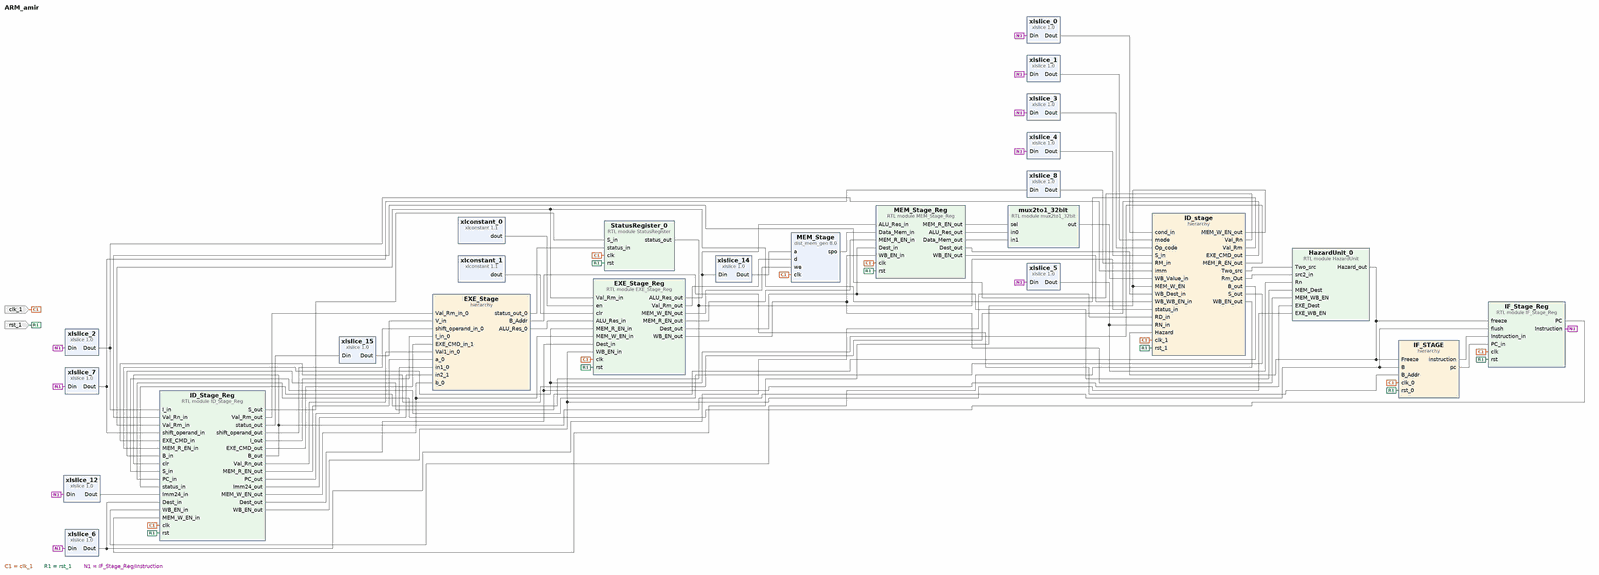
[diagram p0: block diagram of the top level, whole]
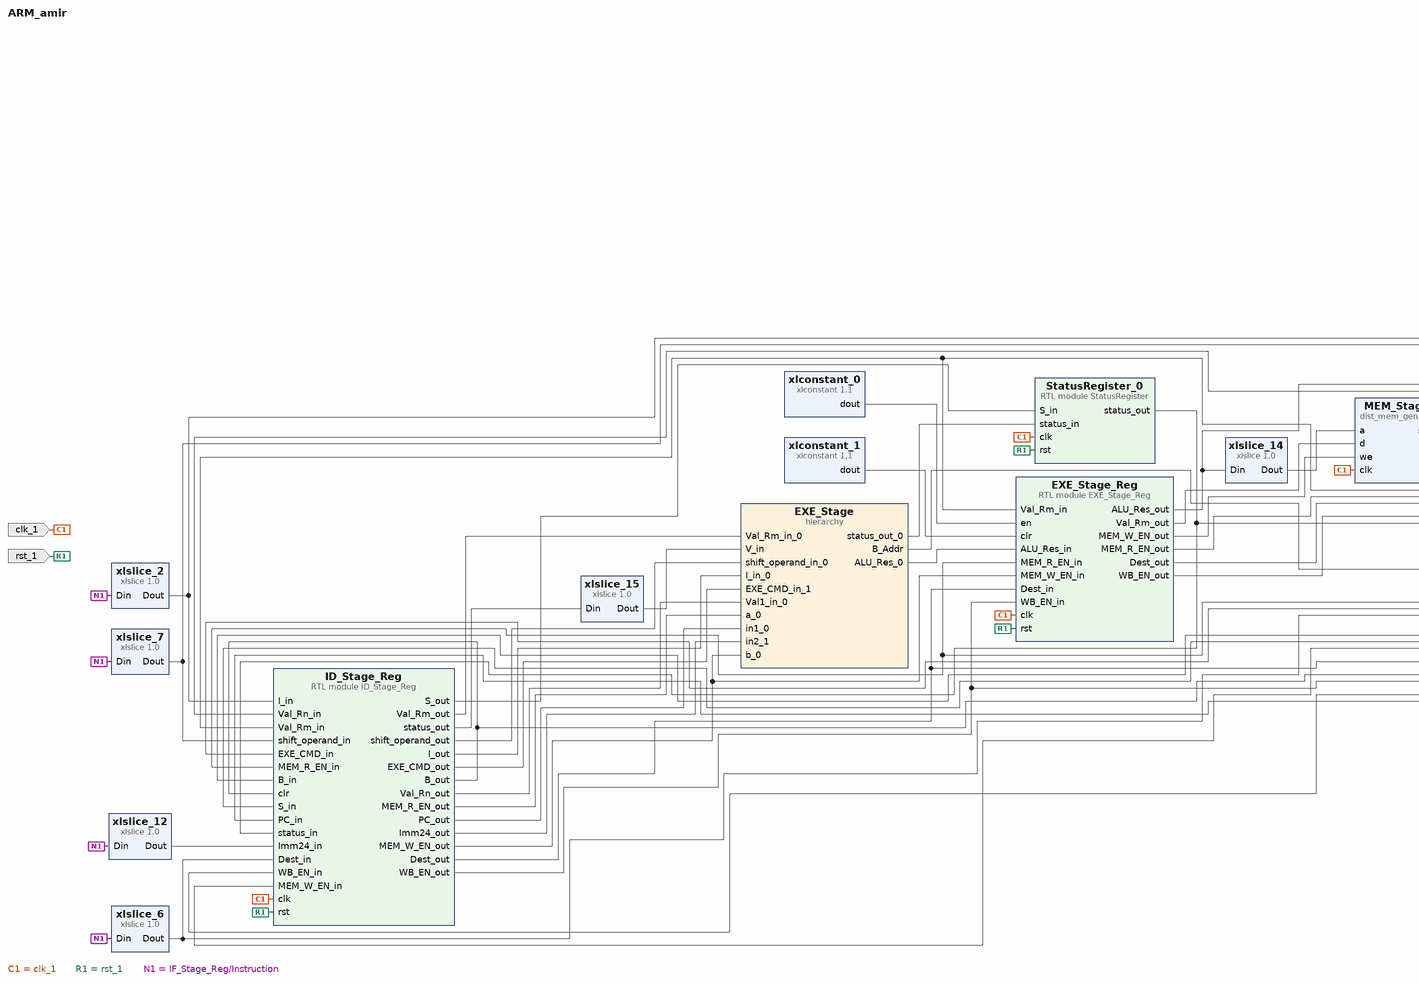
[diagram p1: block diagram of the top level, left part]
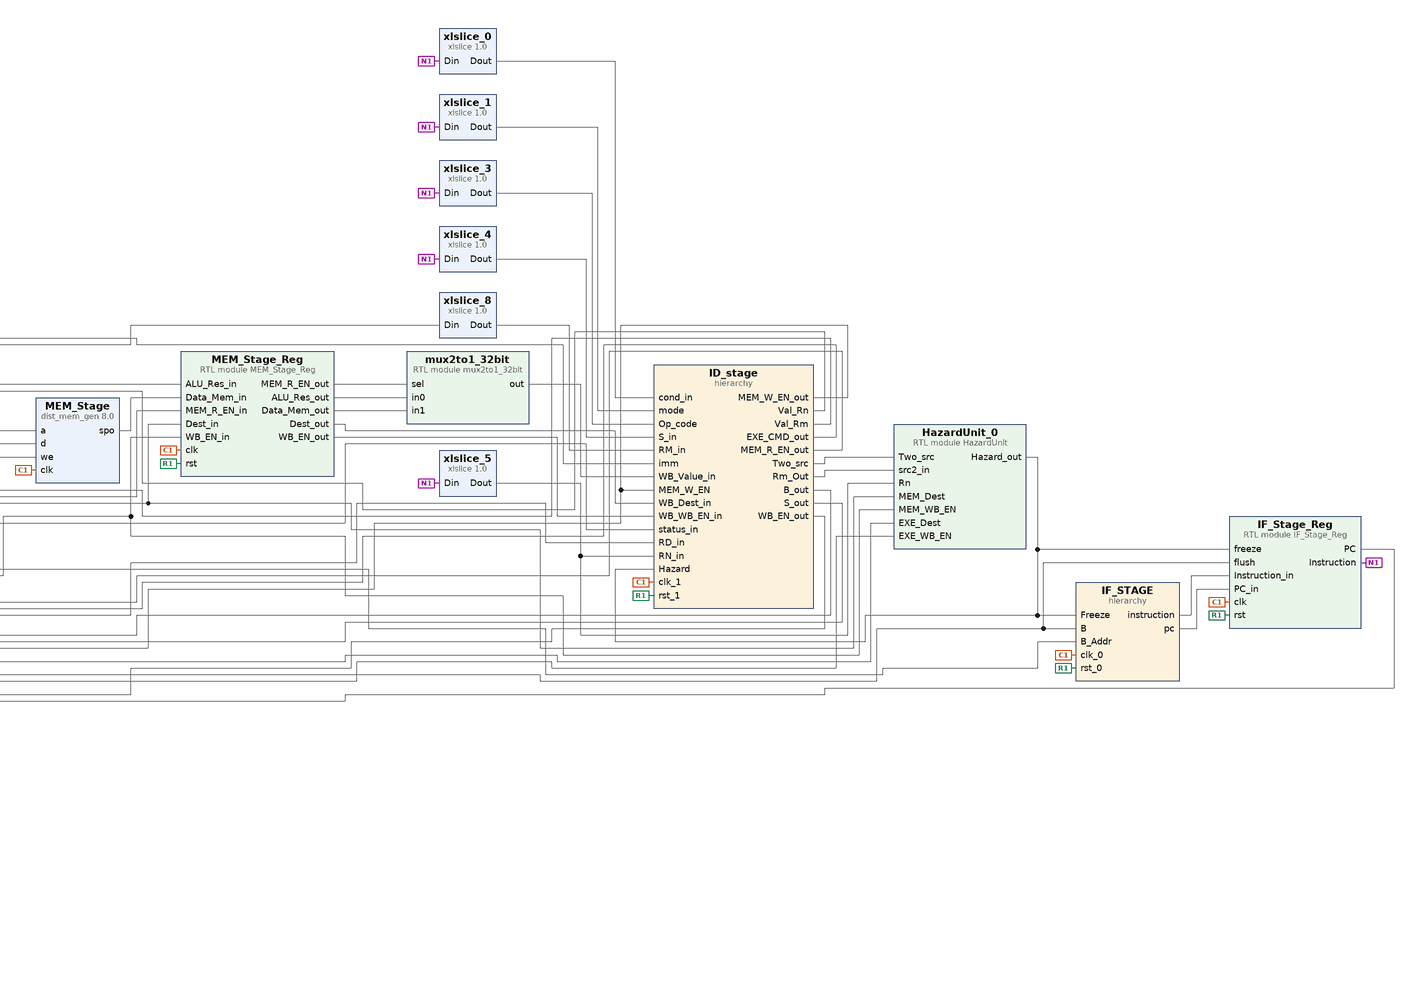
[diagram p2: block diagram of the top level, right part]
# Vivado block design ARM_amir, xc7z010clg400-1, Vivado 2018.3
create_bd_design ARM_amir

create_bd_port -dir I -type clk clk_1
create_bd_port -dir I -type rst rst_1
set_property -dict {CONFIG.POLARITY ACTIVE_HIGH} [get_bd_ports rst_1]

create_bd_cell -type hier IF_STAGE
create_bd_cell -type hier ID_stage
create_bd_cell -type ip -vlnv xilinx.com:ip:xlslice:1.0 xlslice_0
set_property -dict {CONFIG.DIN_FROM 31 CONFIG.DIN_TO 28 CONFIG.DOUT_WIDTH 4} [get_bd_cells xlslice_0]
create_bd_cell -type ip -vlnv xilinx.com:ip:xlslice:1.0 xlslice_1
set_property -dict {CONFIG.DIN_FROM 27 CONFIG.DIN_TO 26 CONFIG.DOUT_WIDTH 2} [get_bd_cells xlslice_1]
create_bd_cell -type ip -vlnv xilinx.com:ip:xlslice:1.0 xlslice_2
set_property -dict {CONFIG.DIN_FROM 25 CONFIG.DIN_TO 25 CONFIG.DOUT_WIDTH 1} [get_bd_cells xlslice_2]
create_bd_cell -type module -reference IF_Stage_Reg IF_Stage_Reg
create_bd_cell -type ip -vlnv xilinx.com:ip:xlslice:1.0 xlslice_3
set_property -dict {CONFIG.DIN_FROM 24 CONFIG.DIN_TO 21 CONFIG.DOUT_WIDTH 4} [get_bd_cells xlslice_3]
create_bd_cell -type ip -vlnv xilinx.com:ip:xlslice:1.0 xlslice_4
set_property -dict {CONFIG.DIN_FROM 20 CONFIG.DIN_TO 20 CONFIG.DOUT_WIDTH 1} [get_bd_cells xlslice_4]
create_bd_cell -type ip -vlnv xilinx.com:ip:xlslice:1.0 xlslice_5
set_property -dict {CONFIG.DIN_FROM 19 CONFIG.DIN_TO 16 CONFIG.DOUT_WIDTH 4} [get_bd_cells xlslice_5]
create_bd_cell -type ip -vlnv xilinx.com:ip:xlslice:1.0 xlslice_6
set_property -dict {CONFIG.DIN_FROM 15 CONFIG.DIN_TO 12 CONFIG.DOUT_WIDTH 4} [get_bd_cells xlslice_6]
create_bd_cell -type ip -vlnv xilinx.com:ip:xlslice:1.0 xlslice_7
set_property -dict {CONFIG.DIN_FROM 11 CONFIG.DOUT_WIDTH 12} [get_bd_cells xlslice_7]
create_bd_cell -type ip -vlnv xilinx.com:ip:xlslice:1.0 xlslice_8
set_property -dict {CONFIG.DIN_FROM 3 CONFIG.DIN_TO 0 CONFIG.DIN_WIDTH 12 CONFIG.DOUT_WIDTH 4} [get_bd_cells xlslice_8]
create_bd_cell -type module -reference ID_Stage_Reg ID_Stage_Reg
create_bd_cell -type ip -vlnv xilinx.com:ip:xlslice:1.0 xlslice_12
set_property -dict {CONFIG.DIN_FROM 23 CONFIG.DOUT_WIDTH 24} [get_bd_cells xlslice_12]
create_bd_cell -type hier EXE_Stage
create_bd_cell -type module -reference EXE_Stage_Reg EXE_Stage_Reg
create_bd_cell -type ip -vlnv xilinx.com:ip:dist_mem_gen:8.0 MEM_Stage
set_property -dict [list \
  CONFIG.coefficient_file c:/Users/amiri/OneDrive/Desktop/output.coe \
  CONFIG.data_width 32 \
  CONFIG.depth 8192 \
] [get_bd_cells MEM_Stage]
create_bd_cell -type ip -vlnv xilinx.com:ip:xlslice:1.0 xlslice_14
set_property -dict {CONFIG.DIN_FROM 12 CONFIG.DIN_TO 0 CONFIG.DIN_WIDTH 32 CONFIG.DOUT_WIDTH 13} [get_bd_cells xlslice_14]
create_bd_cell -type module -reference MEM_Stage_Reg MEM_Stage_Reg
create_bd_cell -type module -reference mux2to1_32bit mux2to1_32bit
create_bd_cell -type module -reference HazardUnit HazardUnit_0
create_bd_cell -type module -reference StatusRegister StatusRegister_0
create_bd_cell -type ip -vlnv xilinx.com:ip:xlconstant:1.1 xlconstant_0
create_bd_cell -type ip -vlnv xilinx.com:ip:xlconstant:1.1 xlconstant_1
set_property -dict {CONFIG.CONST_VAL 0} [get_bd_cells xlconstant_1]
create_bd_cell -type ip -vlnv xilinx.com:ip:xlslice:1.0 xlslice_15
set_property -dict {CONFIG.DIN_FROM 3 CONFIG.DIN_TO 3 CONFIG.DIN_WIDTH 4 CONFIG.DOUT_WIDTH 1} [get_bd_cells xlslice_15]

# ---- hierarchy /IF_STAGE ----
current_bd_instance /IF_STAGE
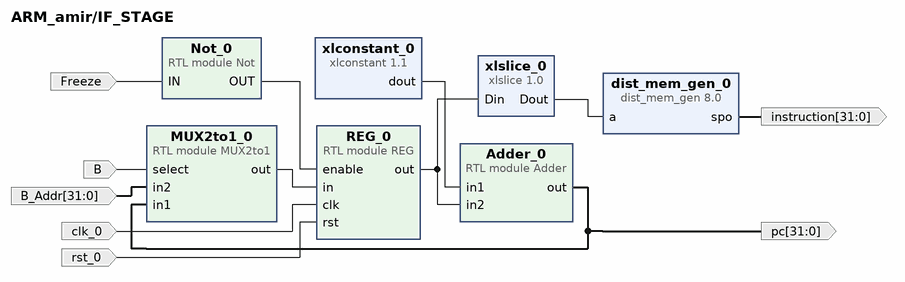
[diagram p3: block diagram inside /IF_STAGE]
create_bd_pin -dir O -from 31 -to 0 pc
create_bd_pin -dir I B
create_bd_pin -dir I -from 31 -to 0 B_Addr
create_bd_pin -dir I -type clk clk_0
create_bd_pin -dir I -type rst rst_0
create_bd_pin -dir O -from 31 -to 0 instruction
create_bd_pin -dir I Freeze

create_bd_cell -type module -reference MUX2to1 MUX2to1_0
create_bd_cell -type ip -vlnv xilinx.com:ip:xlconstant:1.1 xlconstant_0
set_property -dict {CONFIG.CONST_WIDTH 32} [get_bd_cells xlconstant_0]
create_bd_cell -type ip -vlnv xilinx.com:ip:dist_mem_gen:8.0 dist_mem_gen_0
set_property -dict [list \
  CONFIG.coefficient_file c:/Users/amiri/OneDrive/Desktop/output.coe \
  CONFIG.data_width 32 \
  CONFIG.depth 8192 \
  CONFIG.memory_type rom \
] [get_bd_cells dist_mem_gen_0]
create_bd_cell -type ip -vlnv xilinx.com:ip:xlslice:1.0 xlslice_0
set_property -dict {CONFIG.DIN_FROM 12 CONFIG.DOUT_WIDTH 13} [get_bd_cells xlslice_0]
create_bd_cell -type module -reference REG REG_0
create_bd_cell -type module -reference Not Not_0
create_bd_cell -type module -reference Adder Adder_0

# ---- hierarchy /ID_stage ----
current_bd_instance /ID_stage
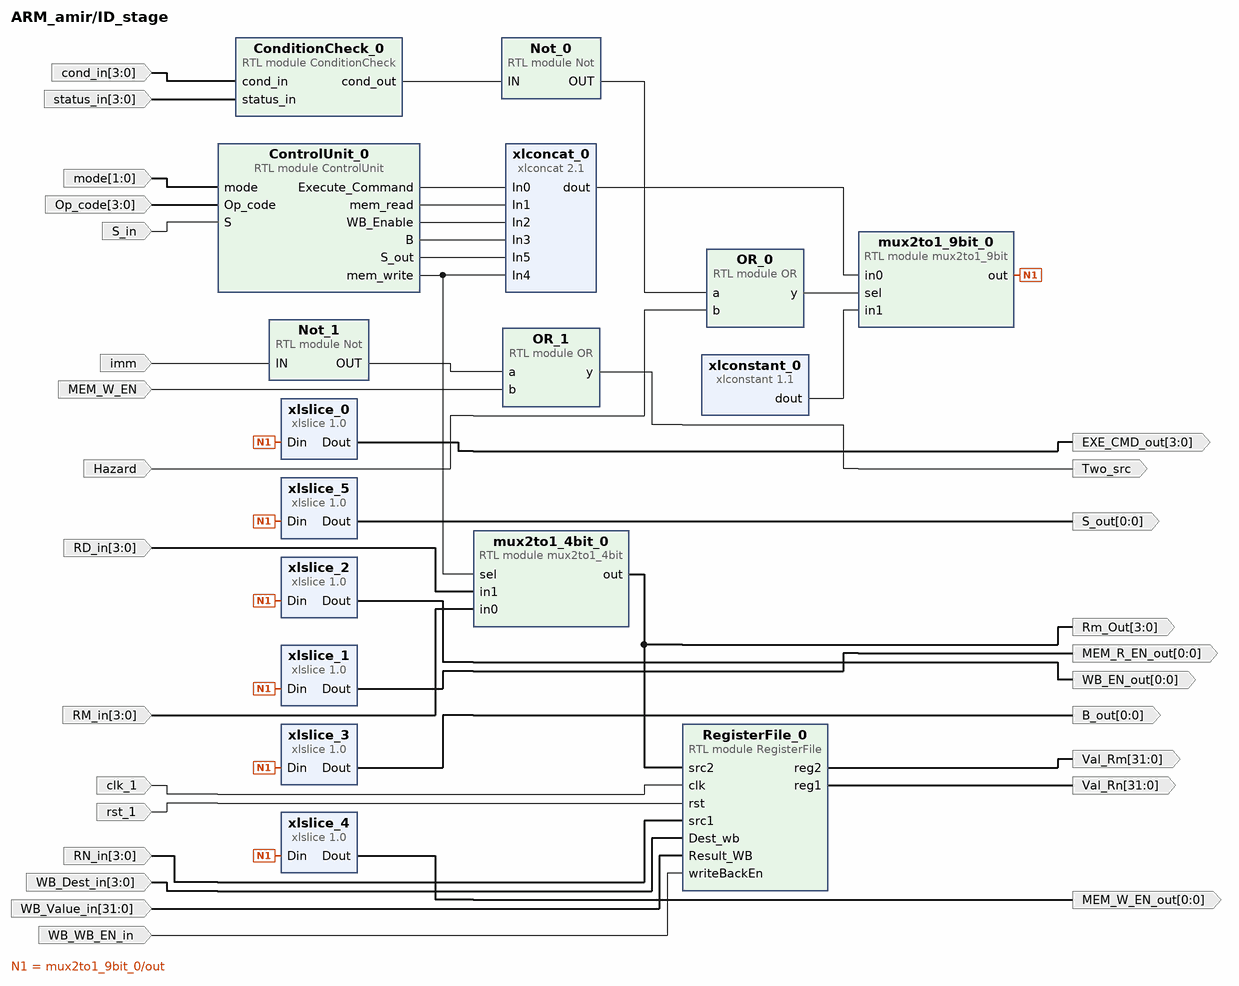
[diagram p4: block diagram inside /ID_stage]
create_bd_pin -dir I -from 3 -to 0 cond_in
create_bd_pin -dir I -from 3 -to 0 status_in
create_bd_pin -dir I -from 1 -to 0 mode
create_bd_pin -dir I -from 3 -to 0 Op_code
create_bd_pin -dir I S_in
create_bd_pin -dir I imm
create_bd_pin -dir I Hazard
create_bd_pin -dir I MEM_W_EN
create_bd_pin -dir O Two_src
create_bd_pin -dir I -type clk clk_1
create_bd_pin -dir I -type rst rst_1
create_bd_pin -dir I -from 3 -to 0 RN_in
create_bd_pin -dir I -from 3 -to 0 WB_Dest_in
create_bd_pin -dir I -from 31 -to 0 WB_Value_in
create_bd_pin -dir I WB_WB_EN_in
create_bd_pin -dir O -from 31 -to 0 Val_Rn
create_bd_pin -dir O -from 31 -to 0 Val_Rm
create_bd_pin -dir I -from 3 -to 0 RD_in
create_bd_pin -dir I -from 3 -to 0 RM_in
create_bd_pin -dir O -from 3 -to 0 EXE_CMD_out
create_bd_pin -dir O -from 0 -to 0 WB_EN_out
create_bd_pin -dir O -from 0 -to 0 MEM_R_EN_out
create_bd_pin -dir O -from 0 -to 0 MEM_W_EN_out
create_bd_pin -dir O -from 0 -to 0 B_out
create_bd_pin -dir O -from 0 -to 0 S_out
create_bd_pin -dir O -from 3 -to 0 Rm_Out

create_bd_cell -type module -reference ConditionCheck ConditionCheck_0
create_bd_cell -type module -reference Not Not_1
create_bd_cell -type module -reference OR OR_1
create_bd_cell -type module -reference RegisterFile RegisterFile_0
create_bd_cell -type module -reference mux2to1_4bit mux2to1_4bit_0
create_bd_cell -type module -reference mux2to1_9bit mux2to1_9bit_0
create_bd_cell -type ip -vlnv xilinx.com:ip:xlconcat:2.1 xlconcat_0
set_property -dict {CONFIG.IN0_WIDTH 4 CONFIG.NUM_PORTS 6} [get_bd_cells xlconcat_0]
create_bd_cell -type ip -vlnv xilinx.com:ip:xlconstant:1.1 xlconstant_0
set_property -dict {CONFIG.CONST_VAL 0 CONFIG.CONST_WIDTH 9} [get_bd_cells xlconstant_0]
create_bd_cell -type ip -vlnv xilinx.com:ip:xlslice:1.0 xlslice_0
set_property -dict {CONFIG.DIN_FROM 3 CONFIG.DIN_TO 0 CONFIG.DIN_WIDTH 9 CONFIG.DOUT_WIDTH 4} [get_bd_cells xlslice_0]
create_bd_cell -type ip -vlnv xilinx.com:ip:xlslice:1.0 xlslice_1
set_property -dict {CONFIG.DIN_FROM 4 CONFIG.DIN_TO 4 CONFIG.DIN_WIDTH 9 CONFIG.DOUT_WIDTH 1} [get_bd_cells xlslice_1]
create_bd_cell -type ip -vlnv xilinx.com:ip:xlslice:1.0 xlslice_2
set_property -dict {CONFIG.DIN_FROM 5 CONFIG.DIN_TO 5 CONFIG.DIN_WIDTH 9} [get_bd_cells xlslice_2]
create_bd_cell -type ip -vlnv xilinx.com:ip:xlslice:1.0 xlslice_3
set_property -dict {CONFIG.DIN_FROM 6 CONFIG.DIN_TO 6 CONFIG.DIN_WIDTH 9 CONFIG.DOUT_WIDTH 1} [get_bd_cells xlslice_3]
create_bd_cell -type ip -vlnv xilinx.com:ip:xlslice:1.0 xlslice_4
set_property -dict {CONFIG.DIN_FROM 7 CONFIG.DIN_TO 7 CONFIG.DIN_WIDTH 9 CONFIG.DOUT_WIDTH 1} [get_bd_cells xlslice_4]
create_bd_cell -type ip -vlnv xilinx.com:ip:xlslice:1.0 xlslice_5
set_property -dict {CONFIG.DIN_FROM 8 CONFIG.DIN_TO 8 CONFIG.DIN_WIDTH 9 CONFIG.DOUT_WIDTH 1} [get_bd_cells xlslice_5]
create_bd_cell -type module -reference OR OR_0
create_bd_cell -type module -reference Not Not_0
create_bd_cell -type module -reference ControlUnit ControlUnit_0

# ---- hierarchy /EXE_Stage ----
current_bd_instance /EXE_Stage
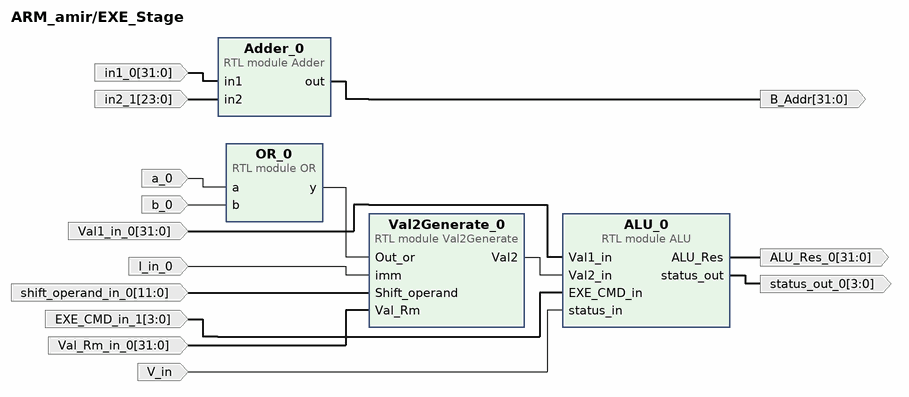
[diagram p5: block diagram inside /EXE_Stage]
create_bd_pin -dir I -from 31 -to 0 Val1_in_0
create_bd_pin -dir I -from 3 -to 0 EXE_CMD_in_1
create_bd_pin -dir I V_in
create_bd_pin -dir O -from 3 -to 0 status_out_0
create_bd_pin -dir O -from 31 -to 0 ALU_Res_0
create_bd_pin -dir I -from 31 -to 0 in1_0
create_bd_pin -dir I -from 23 -to 0 in2_1
create_bd_pin -dir O -from 31 -to 0 B_Addr
create_bd_pin -dir I a_0
create_bd_pin -dir I b_0
create_bd_pin -dir I I_in_0
create_bd_pin -dir I -from 11 -to 0 shift_operand_in_0
create_bd_pin -dir I -from 31 -to 0 Val_Rm_in_0

create_bd_cell -type module -reference ALU ALU_0
create_bd_cell -type module -reference OR OR_0
create_bd_cell -type module -reference Adder Adder_0
create_bd_cell -type module -reference Val2Generate Val2Generate_0

# ---- connections ----

current_bd_instance /IF_STAGE
connect_bd_net [get_bd_pins xlconstant_0/dout] [get_bd_pins Adder_0/in1]
connect_bd_net [get_bd_pins REG_0/out] [get_bd_pins xlslice_0/Din] [get_bd_pins Adder_0/in2]
connect_bd_net [get_bd_pins MUX2to1_0/out] [get_bd_pins REG_0/in]
connect_bd_net [get_bd_pins Adder_0/out] [get_bd_pins pc] [get_bd_pins MUX2to1_0/in1]
connect_bd_net -net select_0_1 [get_bd_pins B] [get_bd_pins MUX2to1_0/select]
connect_bd_net -net in2_0_1 [get_bd_pins B_Addr] [get_bd_pins MUX2to1_0/in2]
connect_bd_net -net clk_0_1 [get_bd_pins clk_0] [get_bd_pins REG_0/clk]
connect_bd_net [get_bd_pins dist_mem_gen_0/spo] [get_bd_pins instruction]
connect_bd_net [get_bd_pins xlslice_0/Dout] [get_bd_pins dist_mem_gen_0/a]
connect_bd_net -net rst_0_1 [get_bd_pins rst_0] [get_bd_pins REG_0/rst]
connect_bd_net [get_bd_pins Freeze] [get_bd_pins Not_0/IN]
connect_bd_net [get_bd_pins Not_0/OUT] [get_bd_pins REG_0/enable]

current_bd_instance /ID_stage
connect_bd_net [get_bd_pins ConditionCheck_0/cond_out] [get_bd_pins Not_0/IN]
connect_bd_net [get_bd_pins ControlUnit_0/Execute_Command] [get_bd_pins xlconcat_0/In0]
connect_bd_net [get_bd_pins ControlUnit_0/mem_read] [get_bd_pins xlconcat_0/In1]
connect_bd_net [get_bd_pins ControlUnit_0/mem_write] [get_bd_pins mux2to1_4bit_0/sel] [get_bd_pins xlconcat_0/In4]
connect_bd_net [get_bd_pins ControlUnit_0/WB_Enable] [get_bd_pins xlconcat_0/In2]
connect_bd_net [get_bd_pins ControlUnit_0/B] [get_bd_pins xlconcat_0/In3]
connect_bd_net [get_bd_pins ControlUnit_0/S_out] [get_bd_pins xlconcat_0/In5]
connect_bd_net [get_bd_pins Not_0/OUT] [get_bd_pins OR_0/a]
connect_bd_net [get_bd_pins Not_1/OUT] [get_bd_pins OR_1/a]
connect_bd_net [get_bd_pins OR_0/y] [get_bd_pins mux2to1_9bit_0/sel]
connect_bd_net [get_bd_pins xlconcat_0/dout] [get_bd_pins mux2to1_9bit_0/in0]
connect_bd_net [get_bd_pins xlconstant_0/dout] [get_bd_pins mux2to1_9bit_0/in1]
connect_bd_net [get_bd_pins mux2to1_9bit_0/out] \
  [get_bd_pins xlslice_0/Din] [get_bd_pins xlslice_1/Din] [get_bd_pins xlslice_2/Din] [get_bd_pins xlslice_3/Din] \
  [get_bd_pins xlslice_4/Din] [get_bd_pins xlslice_5/Din]
connect_bd_net -net cond_in_0_1 [get_bd_pins cond_in] [get_bd_pins ConditionCheck_0/cond_in]
connect_bd_net -net status_in_0_1 [get_bd_pins status_in] [get_bd_pins ConditionCheck_0/status_in]
connect_bd_net -net mode_0_1 [get_bd_pins mode] [get_bd_pins ControlUnit_0/mode]
connect_bd_net -net Op_code_0_1 [get_bd_pins Op_code] [get_bd_pins ControlUnit_0/Op_code]
connect_bd_net -net S_0_1 [get_bd_pins S_in] [get_bd_pins ControlUnit_0/S]
connect_bd_net -net IN_0_1 [get_bd_pins imm] [get_bd_pins Not_1/IN]
connect_bd_net -net b_0_1 [get_bd_pins Hazard] [get_bd_pins OR_0/b]
connect_bd_net -net b_1_1 [get_bd_pins MEM_W_EN] [get_bd_pins OR_1/b]
connect_bd_net [get_bd_pins OR_1/y] [get_bd_pins Two_src]
connect_bd_net -net clk_1_1 [get_bd_pins clk_1] [get_bd_pins RegisterFile_0/clk]
connect_bd_net -net rst_1_1 [get_bd_pins rst_1] [get_bd_pins RegisterFile_0/rst]
connect_bd_net -net src1_0_1 [get_bd_pins RN_in] [get_bd_pins RegisterFile_0/src1]
connect_bd_net -net Dest_wb_0_1 [get_bd_pins WB_Dest_in] [get_bd_pins RegisterFile_0/Dest_wb]
connect_bd_net -net Result_WB_0_1 [get_bd_pins WB_Value_in] [get_bd_pins RegisterFile_0/Result_WB]
connect_bd_net -net writeBackEn_0_1 [get_bd_pins WB_WB_EN_in] [get_bd_pins RegisterFile_0/writeBackEn]
connect_bd_net [get_bd_pins RegisterFile_0/reg1] [get_bd_pins Val_Rn]
connect_bd_net [get_bd_pins RegisterFile_0/reg2] [get_bd_pins Val_Rm]
connect_bd_net [get_bd_pins xlslice_0/Dout] [get_bd_pins EXE_CMD_out]
connect_bd_net [get_bd_pins xlslice_5/Dout] [get_bd_pins S_out]
connect_bd_net [get_bd_pins mux2to1_4bit_0/out] [get_bd_pins Rm_Out] [get_bd_pins RegisterFile_0/src2]
connect_bd_net [get_bd_pins xlslice_2/Dout] [get_bd_pins WB_EN_out]
connect_bd_net [get_bd_pins xlslice_1/Dout] [get_bd_pins MEM_R_EN_out]
connect_bd_net [get_bd_pins xlslice_3/Dout] [get_bd_pins B_out]
connect_bd_net [get_bd_pins xlslice_4/Dout] [get_bd_pins MEM_W_EN_out]
connect_bd_net [get_bd_pins RD_in] [get_bd_pins mux2to1_4bit_0/in1]
connect_bd_net [get_bd_pins RM_in] [get_bd_pins mux2to1_4bit_0/in0]

current_bd_instance /EXE_Stage
connect_bd_net [get_bd_pins Val2Generate_0/Val2] [get_bd_pins ALU_0/Val2_in]
connect_bd_net [get_bd_pins OR_0/y] [get_bd_pins Val2Generate_0/Out_or]
connect_bd_net -net Val1_in_0_1 [get_bd_pins Val1_in_0] [get_bd_pins ALU_0/Val1_in]
connect_bd_net -net EXE_CMD_in_1_1 [get_bd_pins EXE_CMD_in_1] [get_bd_pins ALU_0/EXE_CMD_in]
connect_bd_net -net status_in_2_1 [get_bd_pins V_in] [get_bd_pins ALU_0/status_in]
connect_bd_net [get_bd_pins ALU_0/status_out] [get_bd_pins status_out_0]
connect_bd_net [get_bd_pins ALU_0/ALU_Res] [get_bd_pins ALU_Res_0]
connect_bd_net -net in1_0_1 [get_bd_pins in1_0] [get_bd_pins Adder_0/in1]
connect_bd_net -net in2_1_1 [get_bd_pins in2_1] [get_bd_pins Adder_0/in2]
connect_bd_net [get_bd_pins Adder_0/out] [get_bd_pins B_Addr]
connect_bd_net -net a_0_1 [get_bd_pins a_0] [get_bd_pins OR_0/a]
connect_bd_net -net b_0_2 [get_bd_pins b_0] [get_bd_pins OR_0/b]
connect_bd_net -net I_in_0_1 [get_bd_pins I_in_0] [get_bd_pins Val2Generate_0/imm]
connect_bd_net -net shift_operand_in_0_1 [get_bd_pins shift_operand_in_0] [get_bd_pins Val2Generate_0/Shift_operand]
connect_bd_net -net Val_Rm_in_0_1 [get_bd_pins Val_Rm_in_0] [get_bd_pins Val2Generate_0/Val_Rm]

current_bd_instance /
connect_bd_net -net clk_1_1 [get_bd_ports clk_1] \
  [get_bd_pins ID_stage/clk_1] [get_bd_pins IF_STAGE/clk_0] [get_bd_pins StatusRegister_0/clk] \
  [get_bd_pins MEM_Stage_Reg/clk] [get_bd_pins MEM_Stage/clk] [get_bd_pins EXE_Stage_Reg/clk] [get_bd_pins IF_Stage_Reg/clk] \
  [get_bd_pins ID_Stage_Reg/clk]
connect_bd_net -net rst_1_1 [get_bd_ports rst_1] \
  [get_bd_pins ID_stage/rst_1] [get_bd_pins IF_STAGE/rst_0] [get_bd_pins StatusRegister_0/rst] \
  [get_bd_pins MEM_Stage_Reg/rst] [get_bd_pins EXE_Stage_Reg/rst] [get_bd_pins IF_Stage_Reg/rst] \
  [get_bd_pins ID_Stage_Reg/rst]
connect_bd_net [get_bd_pins IF_STAGE/instruction] [get_bd_pins IF_Stage_Reg/Instruction_in]
connect_bd_net -net IF_Stage_Reg_0_Instruction [get_bd_pins IF_Stage_Reg/Instruction] \
  [get_bd_pins xlslice_0/Din] [get_bd_pins xlslice_1/Din] [get_bd_pins xlslice_2/Din] [get_bd_pins xlslice_3/Din] \
  [get_bd_pins xlslice_4/Din] [get_bd_pins xlslice_5/Din] [get_bd_pins xlslice_6/Din] [get_bd_pins xlslice_7/Din] \
  [get_bd_pins xlslice_12/Din]
connect_bd_net [get_bd_pins xlslice_0/Dout] [get_bd_pins ID_stage/cond_in]
connect_bd_net [get_bd_pins xlslice_1/Dout] [get_bd_pins ID_stage/mode]
connect_bd_net -net imm_1 [get_bd_pins xlslice_2/Dout] [get_bd_pins ID_stage/imm] [get_bd_pins ID_Stage_Reg/I_in]
connect_bd_net [get_bd_pins xlslice_3/Dout] [get_bd_pins ID_stage/Op_code]
connect_bd_net -net S_in_1 [get_bd_pins xlslice_4/Dout] [get_bd_pins ID_stage/S_in]
connect_bd_net -net RN_in_1 [get_bd_pins xlslice_5/Dout] [get_bd_pins ID_stage/RN_in] [get_bd_pins HazardUnit_0/Rn]
connect_bd_net [get_bd_pins xlslice_7/Dout] [get_bd_pins xlslice_8/Din] [get_bd_pins ID_Stage_Reg/shift_operand_in]
connect_bd_net -net RM_in_1 [get_bd_pins xlslice_8/Dout] [get_bd_pins ID_stage/RM_in]
connect_bd_net [get_bd_pins ID_stage/Val_Rn] [get_bd_pins ID_Stage_Reg/Val_Rn_in]
connect_bd_net [get_bd_pins ID_stage/Val_Rm] [get_bd_pins ID_Stage_Reg/Val_Rm_in] [get_bd_pins EXE_Stage_Reg/Val_Rm_in]
connect_bd_net [get_bd_pins ID_stage/EXE_CMD_out] [get_bd_pins ID_Stage_Reg/EXE_CMD_in]
connect_bd_net [get_bd_pins ID_stage/MEM_R_EN_out] [get_bd_pins ID_Stage_Reg/MEM_R_EN_in] [get_bd_pins EXE_Stage_Reg/MEM_R_EN_in]
connect_bd_net [get_bd_pins ID_stage/B_out] [get_bd_pins ID_Stage_Reg/B_in]
connect_bd_net [get_bd_pins ID_stage/S_out] [get_bd_pins ID_Stage_Reg/S_in]
connect_bd_net [get_bd_pins xlslice_12/Dout] [get_bd_pins ID_Stage_Reg/Imm24_in]
connect_bd_net -net ID_Stage_Reg_0_Val_Rm_out [get_bd_pins ID_Stage_Reg/Val_Rm_out] [get_bd_pins EXE_Stage/Val_Rm_in_0]
connect_bd_net -net ID_Stage_Reg_0_shift_operand_out [get_bd_pins ID_Stage_Reg/shift_operand_out] [get_bd_pins EXE_Stage/shift_operand_in_0]
connect_bd_net -net ID_Stage_Reg_0_I_out [get_bd_pins ID_Stage_Reg/I_out] [get_bd_pins EXE_Stage/I_in_0]
connect_bd_net -net ID_Stage_Reg_0_EXE_CMD_out [get_bd_pins ID_Stage_Reg/EXE_CMD_out] [get_bd_pins EXE_Stage/EXE_CMD_in_1]
connect_bd_net -net ID_Stage_Reg_0_Val_Rn_out [get_bd_pins ID_Stage_Reg/Val_Rn_out] [get_bd_pins EXE_Stage/Val1_in_0]
connect_bd_net -net ID_Stage_Reg_0_MEM_R_EN_out [get_bd_pins ID_Stage_Reg/MEM_R_EN_out] [get_bd_pins EXE_Stage/a_0]
connect_bd_net -net ID_Stage_Reg_0_MEM_W_EN_out [get_bd_pins ID_Stage_Reg/MEM_W_EN_out] \
  [get_bd_pins EXE_Stage/b_0] [get_bd_pins EXE_Stage_Reg/MEM_W_EN_in]
connect_bd_net -net ID_Stage_Reg_0_PC_out [get_bd_pins ID_Stage_Reg/PC_out] [get_bd_pins EXE_Stage/in1_0]
connect_bd_net -net ID_Stage_Reg_0_Imm24_out [get_bd_pins ID_Stage_Reg/Imm24_out] [get_bd_pins EXE_Stage/in2_1]
connect_bd_net [get_bd_pins EXE_Stage/ALU_Res_0] [get_bd_pins EXE_Stage_Reg/ALU_Res_in]
connect_bd_net -net EXE_Stage_Reg_0_Val_Rm_out [get_bd_pins EXE_Stage_Reg/Val_Rm_out] [get_bd_pins MEM_Stage/d]
connect_bd_net [get_bd_pins xlslice_14/Dout] [get_bd_pins MEM_Stage/a]
connect_bd_net -net EXE_Stage_Reg_0_MEM_R_EN_out [get_bd_pins EXE_Stage_Reg/MEM_R_EN_out] [get_bd_pins MEM_Stage_Reg/MEM_R_EN_in]
connect_bd_net -net EXE_Stage_Reg_0_Dest_out [get_bd_pins EXE_Stage_Reg/Dest_out] \
  [get_bd_pins MEM_Stage_Reg/Dest_in] [get_bd_pins HazardUnit_0/MEM_Dest]
connect_bd_net -net dist_mem_gen_0_spo [get_bd_pins MEM_Stage/spo] [get_bd_pins MEM_Stage_Reg/Data_Mem_in]
connect_bd_net -net MEM_Stage_Reg_0_MEM_R_EN_out [get_bd_pins MEM_Stage_Reg/MEM_R_EN_out] [get_bd_pins mux2to1_32bit/sel]
connect_bd_net -net WB_Value_in_1 [get_bd_pins mux2to1_32bit/out] [get_bd_pins ID_stage/WB_Value_in]
connect_bd_net -net MEM_Stage_Reg_0_Dest_out [get_bd_pins MEM_Stage_Reg/Dest_out] [get_bd_pins ID_stage/WB_Dest_in]
connect_bd_net -net MEM_Stage_Reg_0_WB_EN_out [get_bd_pins MEM_Stage_Reg/WB_EN_out] [get_bd_pins ID_stage/WB_WB_EN_in]
connect_bd_net [get_bd_pins HazardUnit_0/Hazard_out] [get_bd_pins IF_Stage_Reg/freeze] [get_bd_pins ID_stage/Hazard] [get_bd_pins IF_STAGE/Freeze]
connect_bd_net -net ID_Stage_Reg_0_B_out [get_bd_pins ID_Stage_Reg/B_out] \
  [get_bd_pins IF_STAGE/B] [get_bd_pins IF_Stage_Reg/flush] [get_bd_pins ID_Stage_Reg/clr]
connect_bd_net [get_bd_pins EXE_Stage/B_Addr] [get_bd_pins IF_STAGE/B_Addr]
connect_bd_net -net ID_Stage_Reg_0_S_out [get_bd_pins ID_Stage_Reg/S_out] [get_bd_pins StatusRegister_0/S_in]
connect_bd_net [get_bd_pins ID_stage/Two_src] [get_bd_pins HazardUnit_0/Two_src]
connect_bd_net -net EXE_Stage_Reg_0_ALU_Res_out [get_bd_pins EXE_Stage_Reg/ALU_Res_out] \
  [get_bd_pins MEM_Stage_Reg/ALU_Res_in] [get_bd_pins xlslice_14/Din]
connect_bd_net [get_bd_pins xlconstant_0/dout] [get_bd_pins EXE_Stage_Reg/en]
connect_bd_net [get_bd_pins xlconstant_1/dout] [get_bd_pins EXE_Stage_Reg/clr]
connect_bd_net [get_bd_pins IF_STAGE/pc] [get_bd_pins IF_Stage_Reg/PC_in]
connect_bd_net [get_bd_pins IF_Stage_Reg/PC] [get_bd_pins ID_Stage_Reg/PC_in]
connect_bd_net [get_bd_pins EXE_Stage_Reg/WB_EN_out] [get_bd_pins MEM_Stage_Reg/WB_EN_in] [get_bd_pins HazardUnit_0/MEM_WB_EN]
connect_bd_net [get_bd_pins EXE_Stage_Reg/MEM_W_EN_out] [get_bd_pins MEM_Stage/we]
connect_bd_net [get_bd_pins ID_Stage_Reg/Dest_out] [get_bd_pins EXE_Stage_Reg/Dest_in] [get_bd_pins HazardUnit_0/EXE_Dest]
connect_bd_net -net RD_in_1 [get_bd_pins xlslice_6/Dout] [get_bd_pins ID_stage/RD_in] [get_bd_pins ID_Stage_Reg/Dest_in]
connect_bd_net -net V_in_1 [get_bd_pins xlslice_15/Dout] [get_bd_pins EXE_Stage/V_in]
connect_bd_net [get_bd_pins EXE_Stage/status_out_0] [get_bd_pins StatusRegister_0/status_in]
connect_bd_net [get_bd_pins StatusRegister_0/status_out] [get_bd_pins ID_Stage_Reg/status_in] [get_bd_pins ID_stage/status_in]
connect_bd_net [get_bd_pins ID_Stage_Reg/status_out] [get_bd_pins xlslice_15/Din]
connect_bd_net [get_bd_pins ID_stage/Rm_Out] [get_bd_pins HazardUnit_0/src2_in]
connect_bd_net [get_bd_pins ID_Stage_Reg/WB_EN_out] [get_bd_pins HazardUnit_0/EXE_WB_EN] [get_bd_pins EXE_Stage_Reg/WB_EN_in]
connect_bd_net [get_bd_pins ID_stage/WB_EN_out] [get_bd_pins ID_Stage_Reg/WB_EN_in]
connect_bd_net [get_bd_pins MEM_Stage_Reg/ALU_Res_out] [get_bd_pins mux2to1_32bit/in0]
connect_bd_net [get_bd_pins MEM_Stage_Reg/Data_Mem_out] [get_bd_pins mux2to1_32bit/in1]
connect_bd_net -net MEM_W_EN_1 [get_bd_pins ID_stage/MEM_W_EN_out] [get_bd_pins ID_stage/MEM_W_EN] [get_bd_pins ID_Stage_Reg/MEM_W_EN_in]

validate_bd_design
save_bd_design
